# Altium schematic sheet BW1098OBC_TopLevel.SchDoc: =project_title
size Tabloid; CompanyName: Luxonis Holding; Organization: Luxonis Holding; Address1: 1925 Harmony Park Drive; Address2: Westminster, CO; Address3: 80234; Address4: United States; SheetNumber: 2; SheetTotal: 8
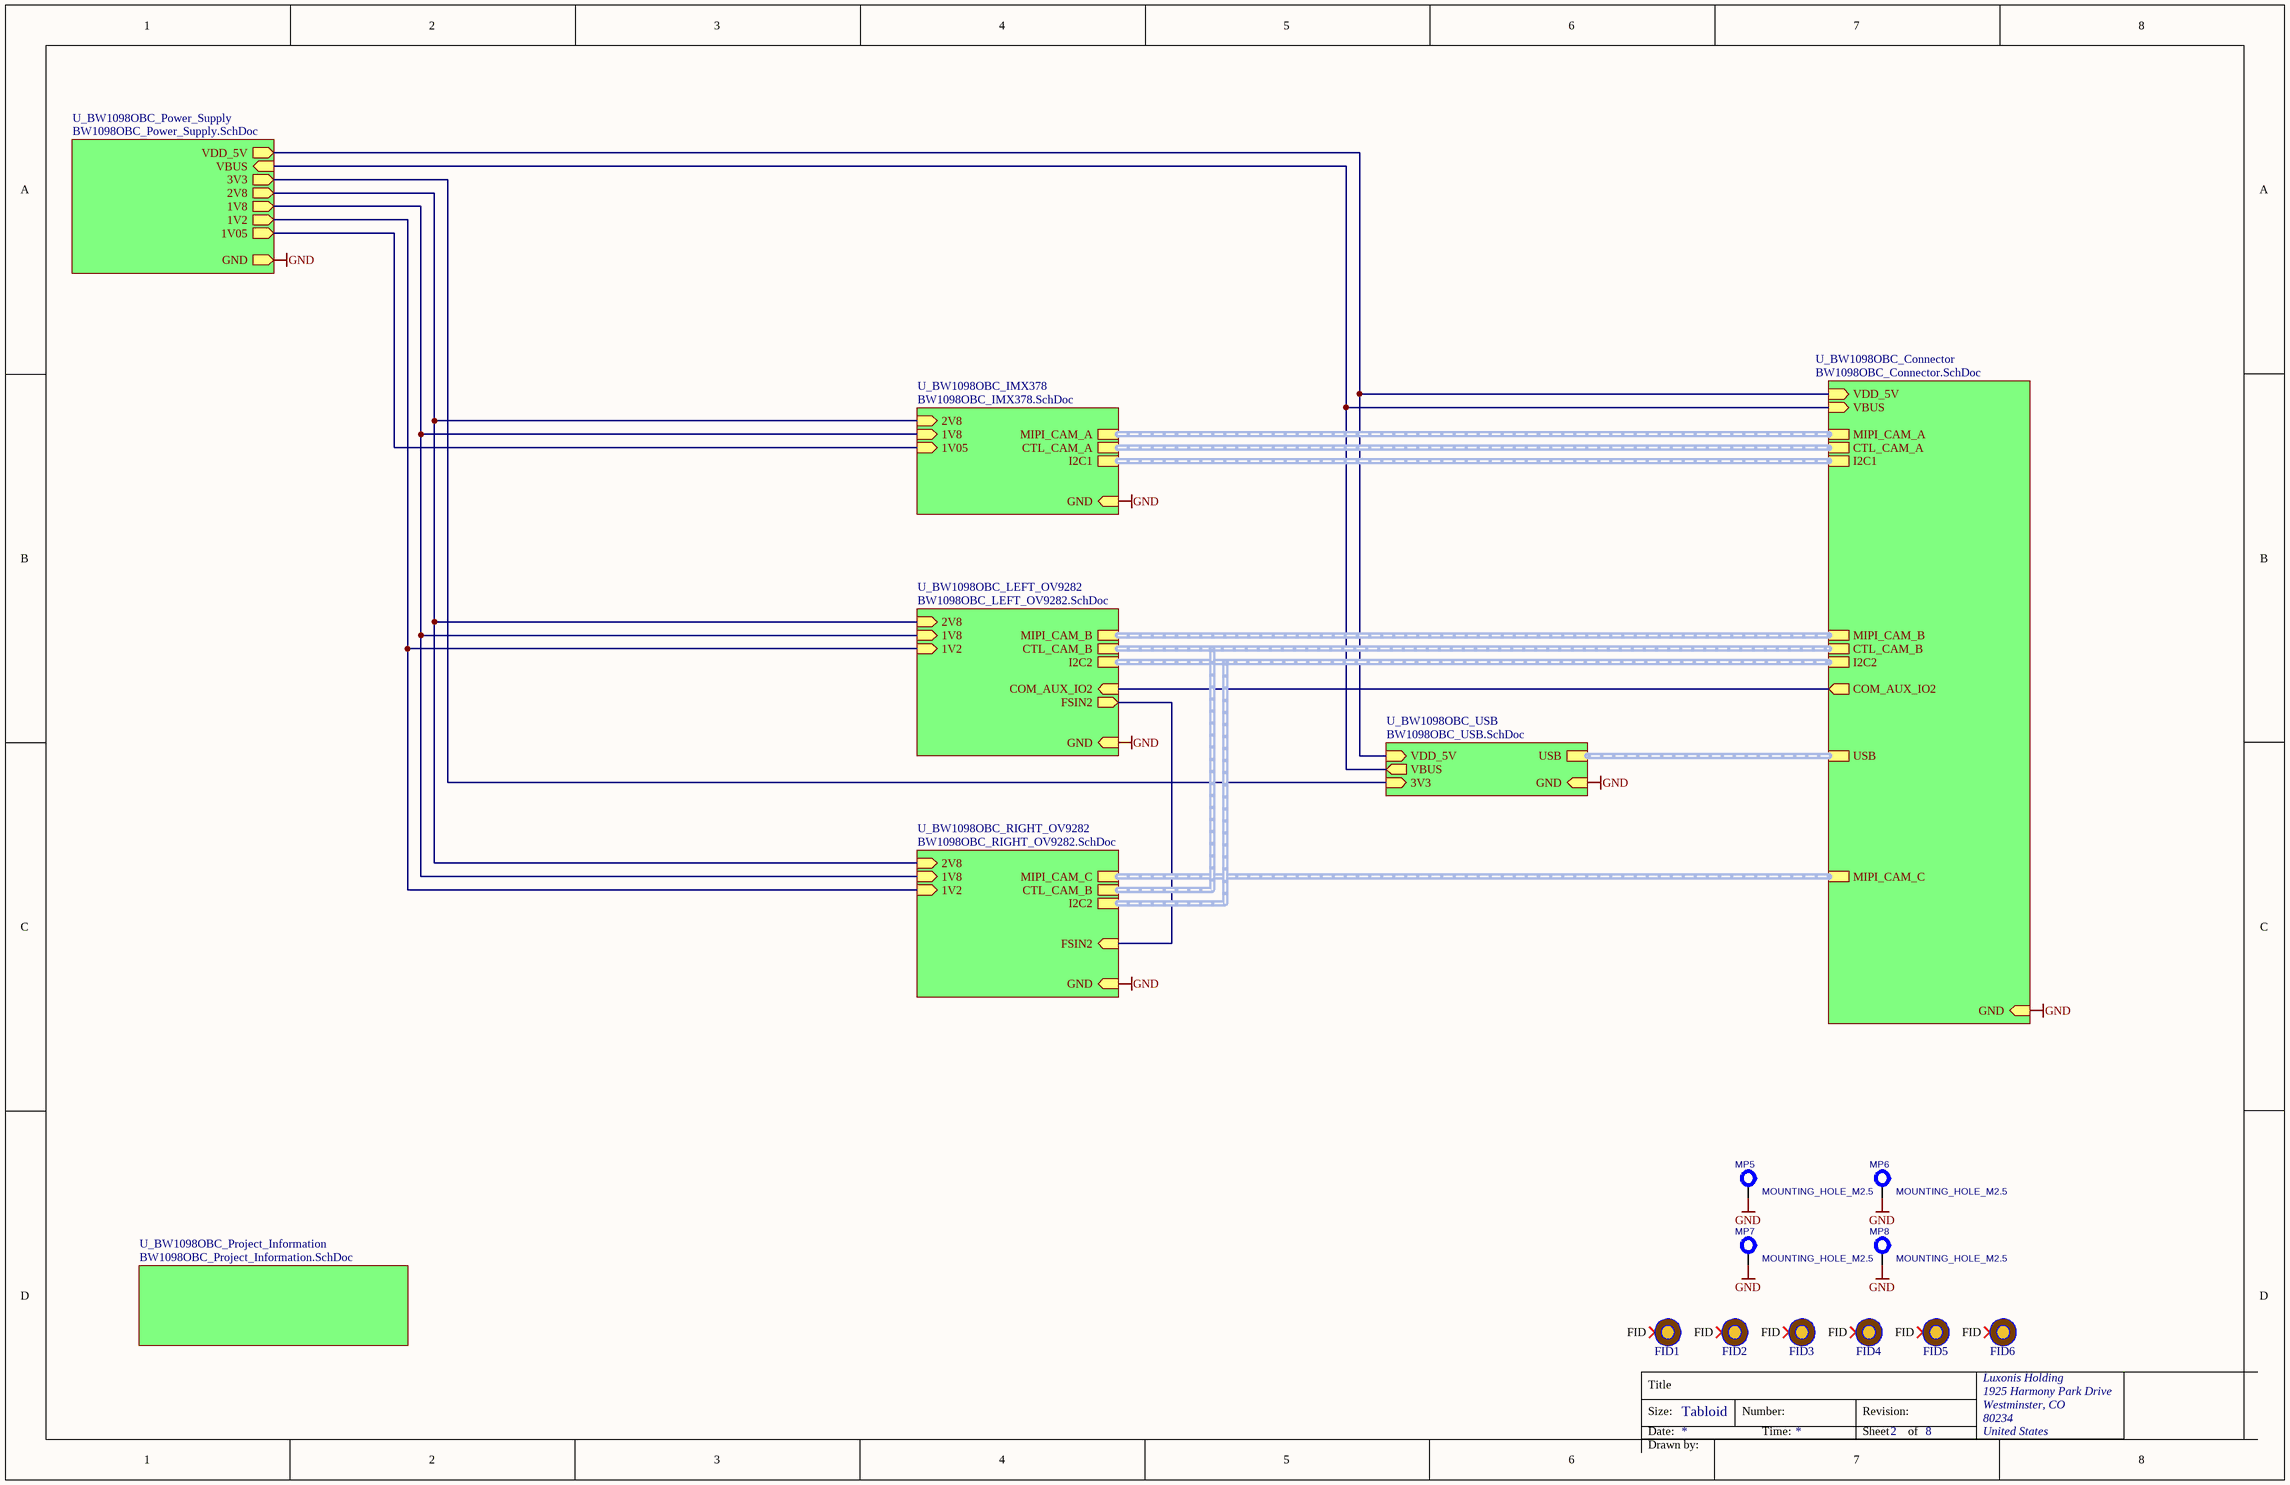
[diagram p0: BW1098OBC_TopLevel.SchDoc]

## Parts
FID1  FIDUCIAL_ROUND_1MM  [FIDUCIAL_ROUND_1MM]  (value not drawn)  (no BOM)
FID2  FIDUCIAL_ROUND_1MM  [FIDUCIAL_ROUND_1MM]  (value not drawn)  (no BOM)
FID3  FIDUCIAL_ROUND_1MM  [FIDUCIAL_ROUND_1MM]  (value not drawn)  (no BOM)
FID4  FIDUCIAL_ROUND_1MM  [FIDUCIAL_ROUND_1MM]  (value not drawn)  (no BOM)
FID5  FIDUCIAL_ROUND_1MM  [FIDUCIAL_ROUND_1MM]  (value not drawn)  (no BOM)
FID6  FIDUCIAL_ROUND_1MM  [FIDUCIAL_ROUND_1MM]  (value not drawn)  (no BOM)
MP5  MOUNTING_HOLE_M2.5  [MOUNTING_HOLE_M2.5]  (no BOM)
MP6  MOUNTING_HOLE_M2.5  [MOUNTING_HOLE_M2.5]  (no BOM)
MP7  MOUNTING_HOLE_M2.5  [MOUNTING_HOLE_M2.5]  (no BOM)
MP8  MOUNTING_HOLE_M2.5  [MOUNTING_HOLE_M2.5]  (no BOM)

## Sub-sheets
U_BW1098OBC_Connector = BW1098OBC_Connector.SchDoc: MIPI_CAM_B (harness MIPI_CAM_B), MIPI_CAM_A (harness MIPI_CAM_A), MIPI_CAM_C (harness MIPI_CAM_C), I2C2 (harness I2C2), I2C1 (harness I2C1), CTL_CAM_A (harness CTL_CAM_A), CTL_CAM_B (harness CTL_CAM_B), VDD_5V (in), GND (in), VBUS (in), USB (harness USB), COM_AUX_IO2 (out)
U_BW1098OBC_IMX378 = BW1098OBC_IMX378.SchDoc: 2V8 (in), 1V05 (in), I2C1 (harness I2C1), MIPI_CAM_A (harness MIPI_CAM_A), CTL_CAM_A (harness CTL_CAM_A), GND (in), 1V8 (in)
U_BW1098OBC_LEFT_OV9282 = BW1098OBC_LEFT_OV9282.SchDoc: I2C2 (harness I2C2), CTL_CAM_B (harness CTL_CAM_B), MIPI_CAM_B (harness MIPI_CAM_B), 1V2 (in), 2V8 (in), GND (in), 1V8 (in), FSIN2 (out), COM_AUX_IO2 (in)
U_BW1098OBC_Power_Supply = BW1098OBC_Power_Supply.SchDoc: 1V2 (out), 2V8 (out), GND (out), 1V8 (out), VDD_5V (out), VBUS (in), 3V3 (out), 1V05 (out)
U_BW1098OBC_Project_Information = BW1098OBC_Project_Information.SchDoc: no entries
U_BW1098OBC_RIGHT_OV9282 = BW1098OBC_RIGHT_OV9282.SchDoc: MIPI_CAM_C (harness MIPI_CAM_C), I2C2 (harness I2C2), 1V2 (in), 2V8 (in), GND (in), 1V8 (in), FSIN2 (in), CTL_CAM_B (harness CTL_CAM_B)
U_BW1098OBC_USB = BW1098OBC_USB.SchDoc: USB (harness USB), VBUS (out), GND (in), 3V3 (in), VDD_5V (in)

## Nets
GND: MP5.1 MP6.1 MP7.1 MP8.1 ; sheet U_BW1098OBC_Power_Supply/GND, sheet U_BW1098OBC_Connector/GND, sheet U_BW1098OBC_IMX378/GND, sheet U_BW1098OBC_RIGHT_OV9282/GND, sheet U_BW1098OBC_LEFT_OV9282/GND, sheet U_BW1098OBC_USB/GND
(unnamed): sheet U_BW1098OBC_Power_Supply/1V2, sheet U_BW1098OBC_RIGHT_OV9282/1V2, sheet U_BW1098OBC_LEFT_OV9282/1V2
(unnamed): sheet U_BW1098OBC_Power_Supply/2V8, sheet U_BW1098OBC_IMX378/2V8, sheet U_BW1098OBC_RIGHT_OV9282/2V8, sheet U_BW1098OBC_LEFT_OV9282/2V8
(unnamed): sheet U_BW1098OBC_Power_Supply/1V8, sheet U_BW1098OBC_IMX378/1V8, sheet U_BW1098OBC_RIGHT_OV9282/1V8, sheet U_BW1098OBC_LEFT_OV9282/1V8
(unnamed): sheet U_BW1098OBC_Power_Supply/VDD_5V, sheet U_BW1098OBC_Connector/VDD_5V, sheet U_BW1098OBC_USB/VDD_5V
(unnamed): sheet U_BW1098OBC_Power_Supply/VBUS, sheet U_BW1098OBC_Connector/VBUS, sheet U_BW1098OBC_USB/VBUS
(unnamed): sheet U_BW1098OBC_Power_Supply/3V3, sheet U_BW1098OBC_USB/3V3
(unnamed): sheet U_BW1098OBC_Power_Supply/1V05, sheet U_BW1098OBC_IMX378/1V05
(unnamed): sheet U_BW1098OBC_Connector/COM_AUX_IO2, sheet U_BW1098OBC_LEFT_OV9282/COM_AUX_IO2
(unnamed): sheet U_BW1098OBC_RIGHT_OV9282/FSIN2, sheet U_BW1098OBC_LEFT_OV9282/FSIN2

Not connected (* = marked no-connect by the designer): FID1 FID*; FID2 FID*; FID3 FID*; FID4 FID*; FID5 FID*; FID6 FID*

## Buses and harness runs
harness sheet U_BW1098OBC_Connector/CTL_CAM_A = sheet U_BW1098OBC_IMX378/CTL_CAM_A
harness sheet U_BW1098OBC_Connector/CTL_CAM_B = sheet U_BW1098OBC_LEFT_OV9282/CTL_CAM_B = sheet U_BW1098OBC_RIGHT_OV9282/CTL_CAM_B
harness sheet U_BW1098OBC_Connector/I2C1 = sheet U_BW1098OBC_IMX378/I2C1
harness sheet U_BW1098OBC_Connector/I2C2 = sheet U_BW1098OBC_LEFT_OV9282/I2C2 = sheet U_BW1098OBC_RIGHT_OV9282/I2C2
harness sheet U_BW1098OBC_Connector/MIPI_CAM_A = sheet U_BW1098OBC_IMX378/MIPI_CAM_A
harness sheet U_BW1098OBC_Connector/MIPI_CAM_B = sheet U_BW1098OBC_LEFT_OV9282/MIPI_CAM_B
harness sheet U_BW1098OBC_Connector/MIPI_CAM_C = sheet U_BW1098OBC_RIGHT_OV9282/MIPI_CAM_C
harness sheet U_BW1098OBC_Connector/USB = sheet U_BW1098OBC_USB/USB

## Notes on the sheet
- Title
- Size:
- Date:
- Tabloid
- Number:
- Time:
- Revision:
- Sheet
- of
- Drawn by:

## Library data of the parts
FID1-FID6 = FIDUCIAL: Fiducial with various available footprints
MP5-MP8 = MP_Mounting-Holes: =CurrentFootprint; B - Value: Not a Part; A - Level: 0